# Altium schematic sheet [05] - Sensors.SchDoc
size A4
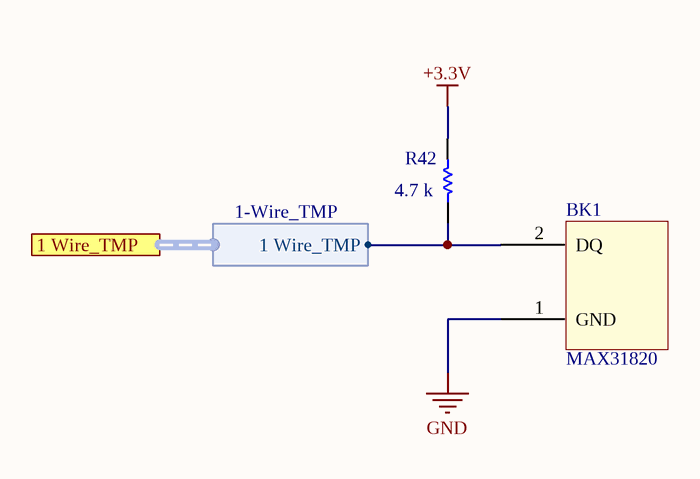
[diagram p0: [05] - Sensors.SchDoc]

## Parts
BK1  MAX31820
R42  Resistance: 4.7 k  [Res-0603]  (hidden comment: Res1)

## Ports
1 Wire_TMP (harness 1-Wire_TMP)

## Harnesses
1-Wire_TMP: 1 Wire_TMP

## Nets
+3.3V: R42.2
GND: BK1.1(GND)
NetBK1_2: BK1.2(DQ) R42.1 ; port 1 Wire_TMP.1 Wire_TMP

## Notes on the sheet
- Title
- Size:
- Date:
- A4
- Number:
- Time:
- Revision:
- Sheet
- of
- File:

## Library data of the parts
BK1 = MAX31820: MAX31820PAR  temper sensor
R42 = 1: Chip Resistor; Manufacturer: Panasonic; Manufacturer Part Number: ERJ-3GEYJ103V; Tolerance: 5%; Power Rating: 100mW; Voltage Rating: 75V; Temperature Coefficient: 200ppm/°C; Voltage Rating (DC): 50V; Supplier 1: Digi-Key; Supplier Part Number 1: P10KGDKR-ND; Stock 1: 10740434; Pricing 1: 1=0.1, 10=0.054, 100=0.022, 1000=0.00988, 2500=0.00858 (USD); Mount: Surface Mount; Case/Package: 0603; Weight: 7.1E-05oz; Case Code (Imperial): 0603; Case Code (Metric): 1608; Contact Plating: Tin; Min Operating Temperature: -55°C; Max Operating Temperature: 155°C; Packaging: Tape and Reel; Package Quantity: 1; Composition: Thick Film; Termination: SMD/SMT; Number of Terminations: 2; Military Standard: Not; Max Power Dissipation: 100mW; Working Voltage: 75V; Features: Automotive AEC-Q200; Length: 1.6mm; Height: 0.45mm; Width: 0.8mm; Depth: 0.8mm; REACH SVHC: No SVHC; Lead Free: Lead Free; ComponentLink1URL: https://datasheet.ciiva.com/34303/2007265-34303757.pdf; ComponentLink1Description: https://datasheet.ciiva.com/34303/2007265-34303757.pdf; ComponentLink2URL: https://datasheet.ciiva.com/11809/0900766b80f806dd-11809566.pdf; ComponentLink2Description: https://datasheet.ciiva.com/11809/0900766b80f806dd-11809566.pdf; ComponentLink3URL: https://datasheet.ciiva.com/28514/1678796-28514213.pdf; ComponentLink3Description: https://datasheet.ciiva.com/28514/1678796-28514213.pdf; ComponentLink4URL: https://datasheet.ciiva.com/30147/4aoa0000ce1-30147029.pdf; ComponentLink4Description: https://datasheet.ciiva.com/30147/4aoa0000ce1-30147029.pdf; ComponentLink5URL: https://datasheet.ciiva.com/46371/1678796-46371909.pdf; ComponentLink5Description: https://datasheet.ciiva.com/46371/1678796-46371909.pdf; ComponentLink6URL: https://datasheet.ciiva.com/24133/aoa0000ce1-37422-24133064.pdf; ComponentLink6Description: https://datasheet.ciiva.com/24133/aoa0000ce1-37422-24133064.pdf; ComponentLink7URL: https://datasheet.ciiva.com/46385/1678796-46385240.pdf; ComponentLink7Description: https://datasheet.ciiva.com/46385/1678796-46385240.pdf; ComponentLink8URL: https://datasheet.ciiva.com/17212/aoa0000ce1-17212106.pdf; ComponentLink8Description: https://datasheet.ciiva.com/17212/aoa0000ce1-17212106.pdf; ComponentLink9URL: https://datasheet.ciiva.com/9117/aoa0000ce1-9117038.pdf; ComponentLink9Description: https://datasheet.ciiva.com/9117/aoa0000ce1-9117038.pdf; ComponentLink10URL: https://datasheet.ciiva.com/16740/aoa0000ce1-16740655.pdf; ComponentLink10Description: https://datasheet.ciiva.com/16740/aoa0000ce1-16740655.pdf; ComponentLink11URL: https://datasheet.ciiva.com/48531/aoa0000ce1-48531887.pdf; ComponentLink11Description: https://datasheet.ciiva.com/48531/aoa0000ce1-48531887.pdf